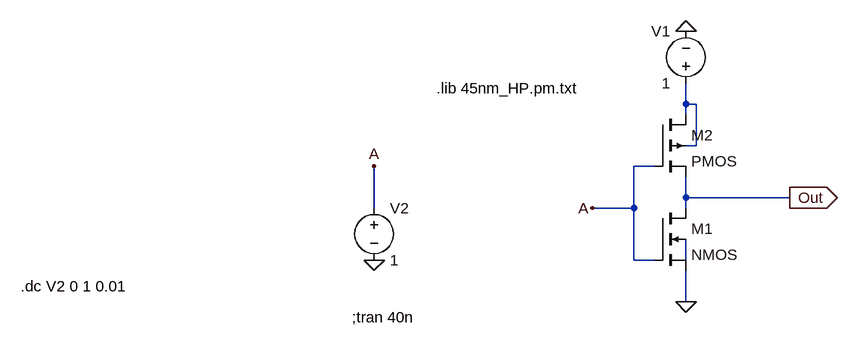
[diagram p0: schematic Draft1.asc]
Draft1.asc, the LTspice schematic file:
Version 4
SHEET 1 880 680
WIRE 96 64 96 32
WIRE 112 64 96 64
WIRE 96 80 96 64
WIRE 112 128 112 64
WIRE 112 128 96 128
WIRE 48 160 16 160
WIRE 96 208 96 176
WIRE 256 208 96 208
WIRE -384 224 -384 160
WIRE 16 224 16 160
WIRE 16 224 -48 224
WIRE 96 224 96 208
WIRE 16 304 16 224
WIRE 48 304 16 304
WIRE 96 304 96 272
WIRE 96 368 96 320
FLAG 96 368 0
FLAG -48 224 A
FLAG 256 208 Out
IOPIN 256 208 Out
FLAG -384 304 0
FLAG -384 160 A
FLAG 96 -48 0
SYMBOL nmos4 48 224 R0
SYMATTR InstName M1
SYMBOL pmos4 48 80 R0
SYMATTR InstName M2
SYMBOL voltage 96 48 R180
WINDOW 0 24 96 Left 2
WINDOW 3 24 16 Left 2
WINDOW 123 0 0 Left 0
WINDOW 39 0 0 Left 0
SYMATTR InstName V1
SYMATTR Value 1
SYMBOL voltage -384 208 R0
WINDOW 123 0 0 Left 0
WINDOW 39 0 0 Left 0
SYMATTR InstName V2
SYMATTR Value 1
TEXT -288 40 Left 2 !.lib 45nm_HP.pm.txt
TEXT -418 392 Left 2 !;tran 40n
TEXT -928 344 Left 2 !.dc V2 0 1 0.01

The netlist it stands for:
* Draft1.asc
M1 Out A 0 N002 NMOS
M2 N001 A Out N001 PMOS
V1 N001 0 1
V2 A 0 1
.model NMOS NMOS
.model PMOS PMOS
.lib standard.mos
.lib 45nm_HP.pm.txt
;tran 40n
.dc V2 0 1 0.01
.backanno
.end

* Results of the author's LTspice run, read from the files saved beside the schematic
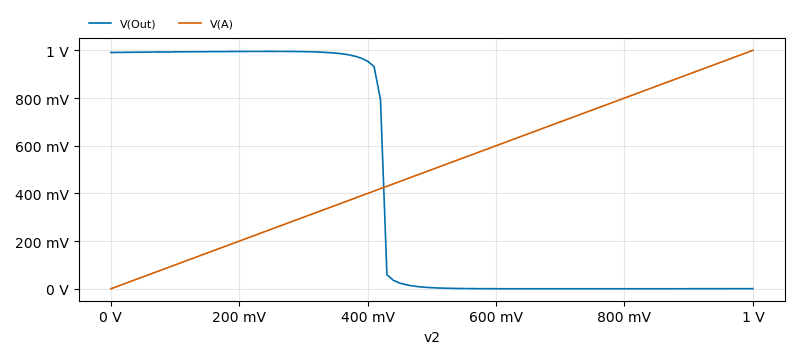
[diagram p1: DC transfer characteristic of Draft1.asc, plotted from the saved traces]
* DC transfer characteristic, 1 run:
*   V(Out): 991.1 mV at v2=0 V, 636.1 µV at v2=1 V, min 135.1 µV, max 995.6 mV
*   V(A): 0 V at v2=0 V, 1 V at v2=1 V, min 0 V, max 1 V